# Altium schematic sheet Balun&Matching.SchDoc
size A4
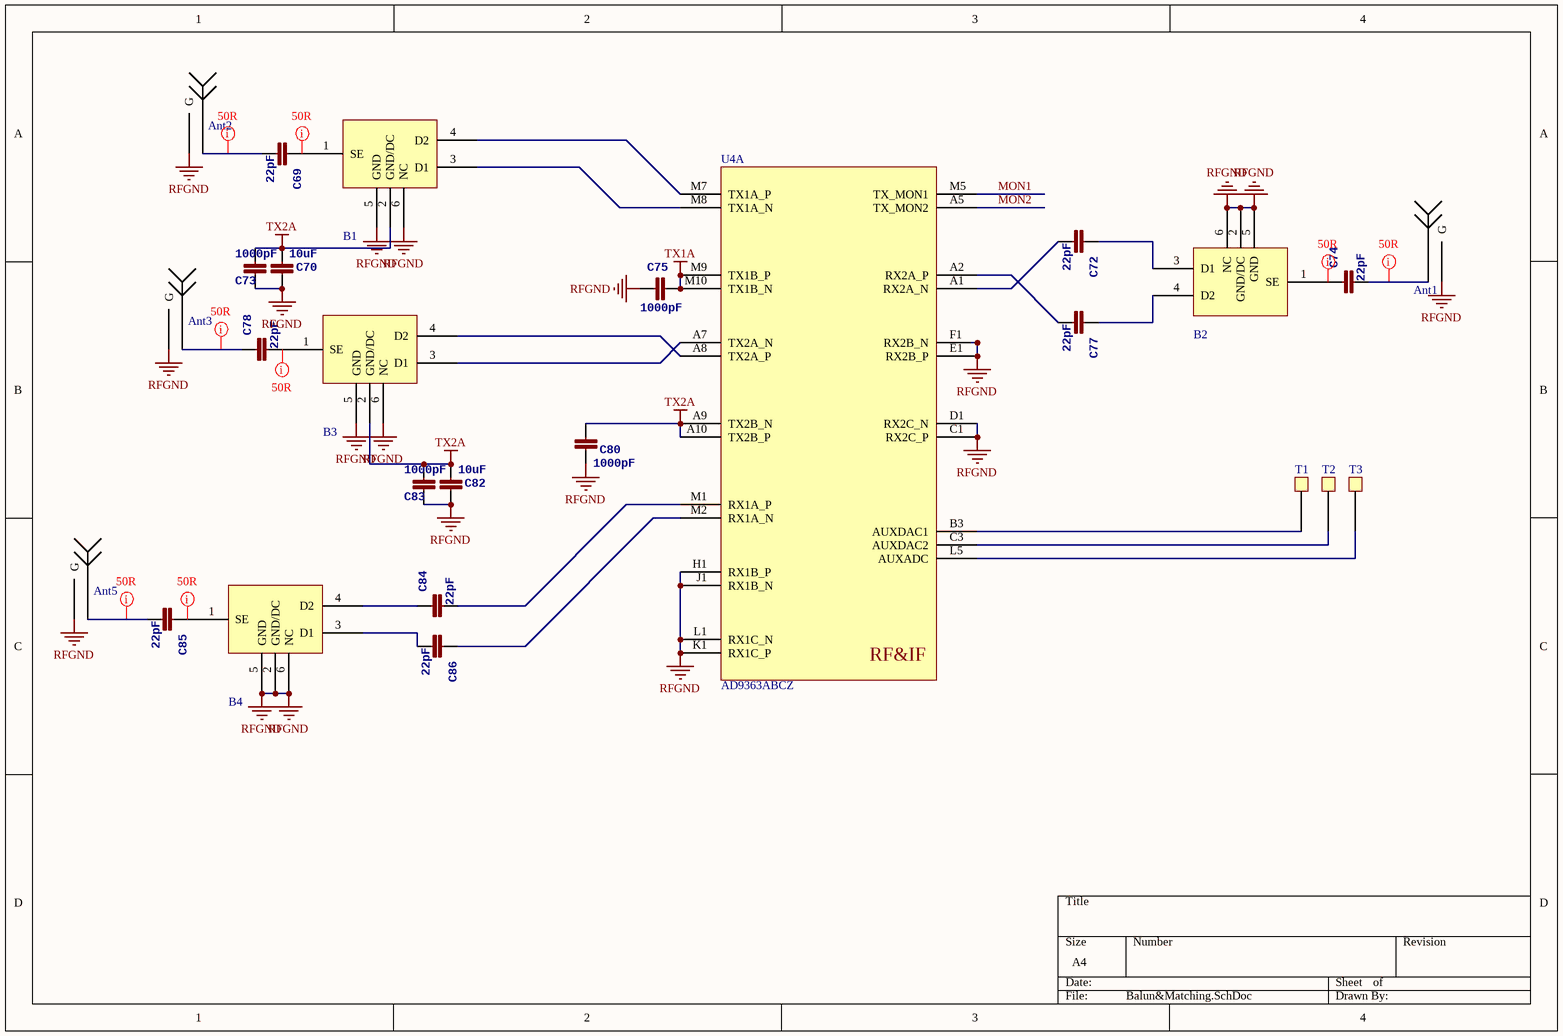
[diagram p0: Balun&Matching.SchDoc]

## Parts
Ant1  Antenna  [SMA-2]  (value not drawn)
Ant2  Antenna  [SMA-2]  (value not drawn)
Ant3  Antenna  [SMA-2]  (value not drawn)
Ant5  Antenna  [SMA-2]  (value not drawn)
B1  Balun  [HHM1711D1/HHM1732B1]  (value not drawn)
B2  Balun  [HHM1711D1/HHM1732B1]  (value not drawn)
B3  Balun  [HHM1711D1/HHM1732B1]  (value not drawn)
B4  Balun  [HHM1711D1/HHM1732B1]  (value not drawn)
C69  22pF  [0402]
C70  10uF  [0805]
C72  22pF  [0402]
C73  1000pF  [0402]
C74  22pF  [0402]
C75  1000pF  [0402]
C77  22pF  [0402]
C78  22pF  [0402]
C80  1000pF  [0402]
C82  10uF  [0805]
C83  1000pF  [0402]
C84  22pF  [0402]
C85  22pF  [0402]
C86  22pF  [0402]
T1  TestPad  [TestPad - 1mm]  (value not drawn)
T2  TestPad  [TestPad - 1mm]  (value not drawn)
T3  TestPad  [TestPad - 1mm]  (value not drawn)
U4  AD9363ABCZ  [AD936X]  (part A of 3)

## Nets
RFGND: Ant1.GND(G) Ant2.GND(G) Ant3.GND(G) Ant5.GND(G) B1.5(GND) B1.6(NC) B2.2(GND/DC) B2.5(GND) B2.6(NC) B3.5(GND) B3.6(NC) B4.2(GND/DC) B4.5(GND) B4.6(NC) C70.1 C73.2 C75.2 C80.2 C82.1 C83.2 U4.C1(RX2C_P) U4.D1(RX2C_N) U4.E1(RX2B_P) U4.F1(RX2B_N) U4.H1(RX1B_P) U4.J1(RX1B_N) U4.K1(RX1C_P) U4.L1(RX1C_N)
TX1A: C75.1 U4.M9(TX1B_P) U4.M10(TX1B_N)
TX2A: B1.2(GND/DC) B3.2(GND/DC) C70.2 C73.1 C80.1 C82.2 C83.1 U4.A9(TX2B_N) U4.A10(TX2B_P)
MON1: U4.M5(TX_MON1)
MON2: U4.A5(TX_MON2)
NetAnt1_1: Ant1.1 C74.2
NetAnt2_1: Ant2.1 C69.2
NetAnt3_1: Ant3.1 C78.1
NetAnt5_1: Ant5.1 C85.2
NetB1_1: B1.1(SE) C69.1
NetB1_3: B1.3(D1) U4.M8(TX1A_N)
NetB1_4: B1.4(D2) U4.M7(TX1A_P)
NetB2_1: B2.1(SE) C74.1
NetB2_3: B2.3(D1) C72.1
NetB2_4: B2.4(D2) C77.1
NetB3_1: B3.1(SE) C78.2
NetB3_3: B3.3(D1) U4.A7(TX2A_N)
NetB3_4: B3.4(D2) U4.A8(TX2A_P)
NetB4_1: B4.1(SE) C85.1
NetB4_3: B4.3(D1) C86.2
NetB4_4: B4.4(D2) C84.1
NetC72_2: C72.2 U4.A1(RX2A_N)
NetC77_2: C77.2 U4.A2(RX2A_P)
NetC84_2: C84.2 U4.M1(RX1A_P)
NetC86_1: C86.1 U4.M2(RX1A_N)
NetT1_1: T1.1 U4.B3(AUXDAC1)
NetT2_1: T2.1 U4.C3(AUXDAC2)
NetT3_1: T3.1 U4.L5(AUXADC)

## Layout directives
net class 50R: NetAnt1_1, NetAnt2_1, NetAnt3_1, NetAnt5_1, NetB1_1, NetB2_1, NetB3_1, NetB4_1

## Notes on the sheet
- (in symbol AD9363ABCZ, part A) RF&IF

## Library data of the parts
C69 C70 C72-C75 C77 C78 C80 C82-C86 = CAP0402-CAP: <b>Capacitor</b> / Standard 0603 ceramic capacitor, and 0.1" leaded capacitor.; PARTNO: CC0402ZRY5V7BB104
U4 = AD9363ABCZ: Imported; Value: Value; Type: Type; RefDes: RefDes